# EAGLE design DHT22 (EAGLE 7.5.0)
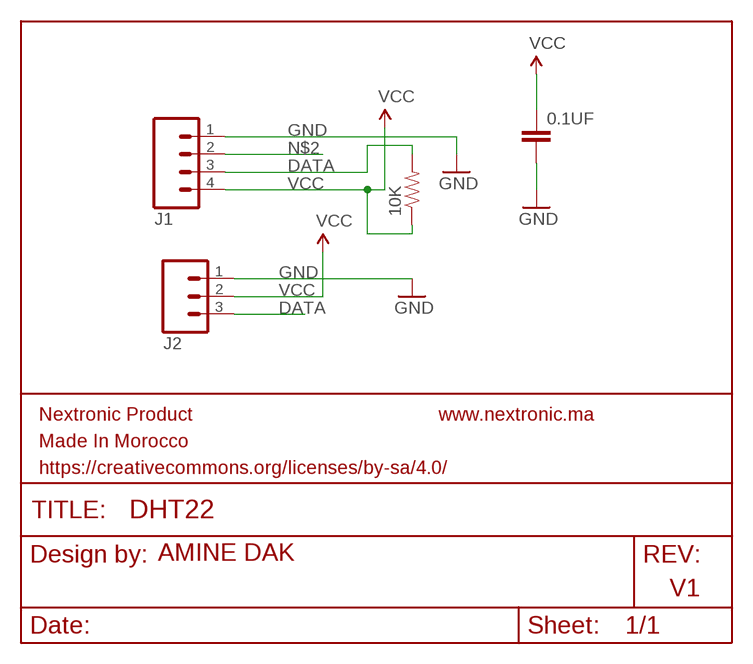
[diagram p0: schematic, sheet 1]

## Parts
0.1UF  CAP0603-CAP  [0603-CAP]
10K  RESISTOR0603-RES  [0603-RES]
J1  M04PTH  [1X04]
J2  M03PTH  [1X03]

## Nets
DATA: 10K.2 J1.3 J2.3
GND: 0.1UF.2 J1.1 J2.1
N$2: J1.2
VCC: 0.1UF.1 10K.1 J1.4 J2.2

## Notes on the sheet
- Nextronic Product | www.nextronic.ma
- Made In Morocco
- https://creativecommons.org/licenses/by-sa/4.0/
- TITLE:
- Design by: | AMINE DAK | REV:
- V1
- Date: | Sheet:

## Library data of the parts
0.1UF = SparkFun-Passives:CAP: Capacitor Standard 0603 ceramic capacitor, and 0.1" leaded capacitor.
10K = SparkFun-Passives:RESISTOR: Resistor Basic schematic elements and footprints for 0603, 1206, and PTH resistors.
J1 = SparkFun-Connectors:M04: Header 4 Standard 4-pin 0.1" header. Use with straight break away headers (SKU : PRT-00116), right angle break away headers (PRT-00553), swiss pins (PRT-00743), machine pins (PRT-00117), and female headers (PRT-00115). Molex polarized connector foot print use with SKU : PRT-08231 with associated crimp pins and housings. 1MM SMD Version SKU: PRT-10208; PROD_ID: CONN-09696
J2 = SparkFun-Connectors:M03: Header 3 Standard 3-pin 0.1" header. Use with straight break away headers (SKU : PRT-00116), right angle break away headers (PRT-00553), swiss pins (PRT-00743), machine pins (PRT-00117), and female headers (PRT-00115). Molex polarized connector foot print use with SKU : PRT-08232 with associated crimp pins and housings.

## Board
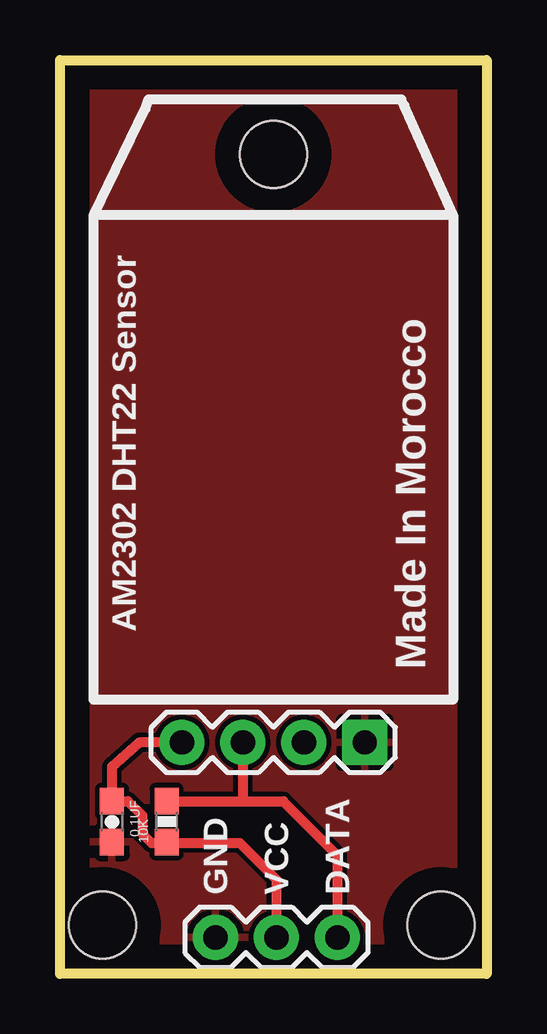
[diagram p1: board, top side]
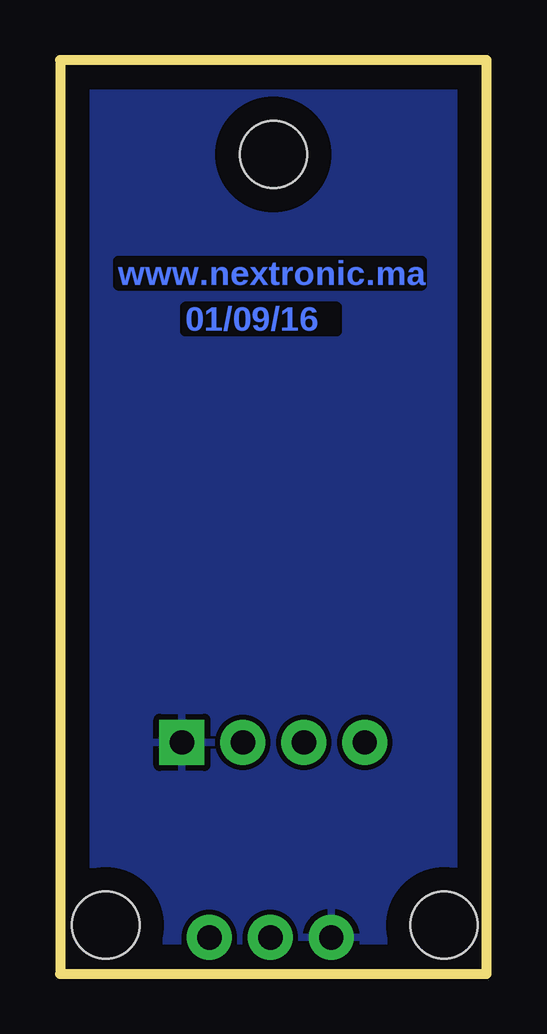
[diagram p2: board, bottom side, seen from below]

Size 17.78 x 38.1 mm. Coordinates in mm from the lower left corner, seen from the top.
Outline: 17.78,0 0,0 0,38.1 17.78,38.1 17.78,0
Copper layers (1*16): Top 0.035mm / dielectric 1.5mm / Bottom 0.035mm
Design rules "default": minimum track width 10mil, minimum drill 24mil, track to track 8mil, track to pad 8mil, pad to pad 8mil, via to via 8mil, smd to smd 8mil, copper to edge 40mil, drill to drill 8mil, minimum pad ring 10mil, minimum via ring 8mil, stop-mask expansion 4mil, vias tented up to drill 0mil, thermal gap 10mil
Holes 2.8 mm at 8.89,34.16 15.88,2.03 1.78,2.03

### Footprints (pad centres in the part's own frame; a part is rotated, then mirrored left to right if it is on the bottom)
0603-CAP = smd 1.1 x 1: 1 -0.85,0; 2 0.85,0
0603-RES = smd 1.1 x 1: 1 -0.85,0; 2 0.85,0
1X04 = drill 1.016 pad 1.88 square: 1 0,0 | drill 1.016 pad 1.88: 2 2.54,0; 3 5.08,0; 4 7.62,0
1X03 = drill 1.016 pad 1.88: 1 0,0; 2 2.54,0; 3 5.08,0

### Placement (x,y rotation side)
0.1UF  2.16,6.35 270 top
10K  4.45,6.35 90 top
J1  12.7,9.65 180 top
J2  6.48,1.52 0 top

### Tracks (layer width: path | path; a pad name or v marks a point on that pad's centre or on a via)
DATA
  Top 0.406: 10K.2 7.62,7.2 | 7.62,7.2 9.31,7.2 11.56,4.95 J2.3 | J1.3 7.62,7.2
GND
  pour Top: 0,0 0,38.1 17.78,38.1 17.78,0
  pour Bottom: 0,0 0,38.1 17.78,38.1 17.78,0
VCC
  Top 0.406: J1.4 3.3,9.65 2.16,8.64 0.1UF.1 2.83,7.2 3.43,6.6 3.43,5.84 3.81,5.46 4.41,5.46 | 4.41,5.46 10K.1 | 4.41,5.46 7.49,5.46 9.02,3.94 J2.2

### Text on the board
Bottom: www.nextronic.ma | 01/09/16
tPlace: AM2302 DHT22 Sensor | Made In Morocco | GND | VCC | DATA